# Altium project 数传模块.PrjPCB
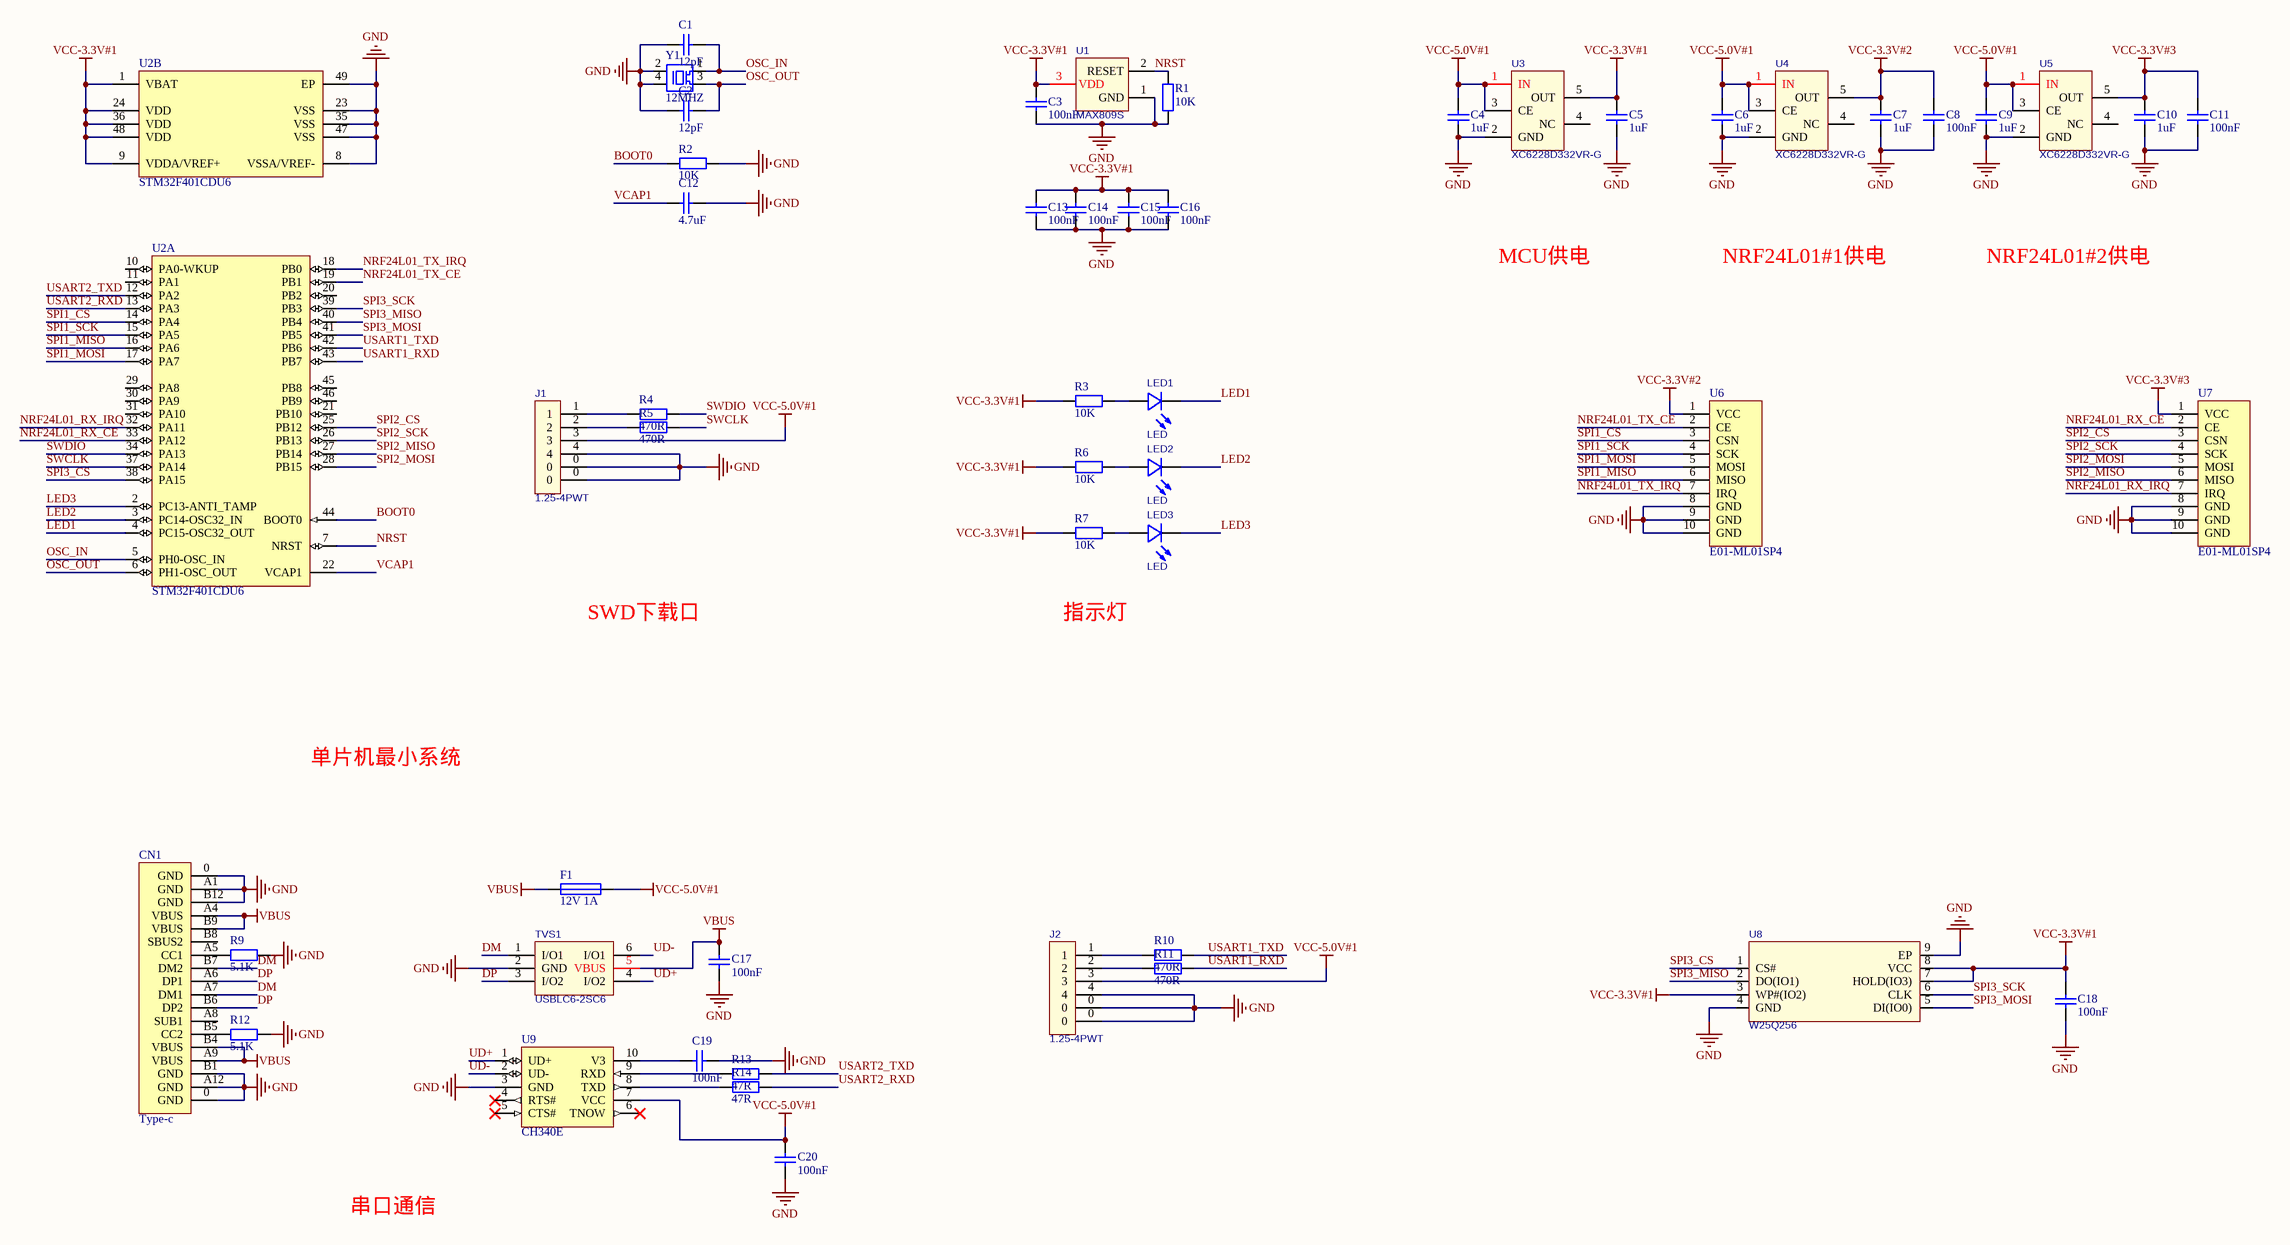
[diagram p0: 数传模块.SchDoc]
1 sheet, 51 parts. Net scope: global (net labels, ports and power ports of the same name join across sheets).
Board file: 数传模块.PcbDoc

## Sheet 数传模块.SchDoc
size A2

### Parts
C1  12pF  [0603-C]
C2  12pF  [0603-C]
C3  100nF  [0603-C]
C4  1uF  [0603-C]
C5  1uF  [0603-C]
C6  1uF  [0603-C]
C7  1uF  [0603-C]
C8  100nF  [0603-C]
C9  1uF  [0603-C]
C10  1uF  [0603-C]
C11  100nF  [0603-C]
C12  4.7uF  [0603-C]
C13  100nF  [0603-C]
C14  100nF  [0603-C]
C15  100nF  [0603-C]
C16  100nF  [0603-C]
C17  100nF  [0603-C]
C18  100nF  [0603-C]
C19  100nF  [0603-C]
C20  100nF  [0603-C]
CN1  Type-c  [Type-c 16pin]
F1  12V 1A  [0805-FUSE]
J1  1.25-4PWT  [H1.25-4P]
J2  1.25-4PWT  [H1.25-4P]
LED1  LED  [LED-0603]
LED2  LED  [LED-0603]
LED3  LED  [LED-0603]
R1  10K  [0603-R]
R2  10K  [0603-R]
R3  10K  [0603-R]
R4  470R  [0603-R]
R5  470R  [0603-R]
R6  10K  [0603-R]
R7  10K  [0603-R]
R9  5.1K  [0603-R]
R10  470R  [0603-R]
R11  470R  [0603-R]
R12  5.1K  [0603-R]
R13  47R  [0603-R]
R14  47R  [0603-R]
TVS1  USBLC6-2SC6  [USBLC6-2]
U1  MAX809S  [MAX809S]
U2  STM32F401CDU6  [STM32F401CDU6]  (parts A,B of 2)
U3  XC6228D332VR-G  [XC6228D332VR-G]
U4  XC6228D332VR-G  [XC6228D332VR-G]
U5  XC6228D332VR-G  [XC6228D332VR-G]
U6  E01-ML01SP4  [PE01-ML01SP4]
U7  E01-ML01SP4  [PE01-ML01SP4]
U8  W25Q256  [W25Q256]
U9  CH340E  [CH340E]
Y1  12MHZ  [3225]

### Nets
GND: C1.1 C2.1 C3.2 C4.1 C5.1 C6.1 C7.1 C8.1 C9.1 C10.1 C11.1 C12.2 C13.1 C14.1 C15.1 C16.1 C17.2 C18.2 C19.2 C20.2 CN1.0(GND) CN1.A1(GND) CN1.A12(GND) CN1.B1(GND) CN1.B12(GND) J1.0 J1.4 J2.0 J2.4 R1.1 R2.2 R9.1 R12.2 TVS1.2(GND) U1.1(GND) U2.8(VSSA/VREF-) U2.23(VSS) U2.35(VSS) U2.47(VSS) U2.49(EP) U3.2(GND) U4.2(GND) U5.2(GND) U6.8(GND) U6.9(GND) U6.10(GND) U7.8(GND) U7.9(GND) U7.10(GND) U8.4(GND) U8.9(EP) U9.3(GND) Y1.2(GND) Y1.4(GND)
VBUS: C17.1 CN1.A4(VBUS) CN1.A9(VBUS) CN1.B4(VBUS) CN1.B9(VBUS) F1.2 TVS1.5(VBUS)
VCC-3.3V#1: C3.1 C5.2 C13.2 C14.2 C15.2 C16.2 C18.1 R3.2 R6.2 R7.2 U1.3(VDD) U2.1(VBAT) U2.9(VDDA/VREF+) U2.24(VDD) U2.36(VDD) U2.48(VDD) U3.5(OUT) U8.3(WP#(IO2)) U8.7(HOLD(IO3)) U8.8(VCC)
VCC-3.3V#2: C7.2 C8.2 U4.5(OUT) U6.1(VCC)
VCC-3.3V#3: C10.2 C11.2 U5.5(OUT) U7.1(VCC)
VCC-5.0V#1: C4.2 C6.2 C9.2 C20.1 F1.1 J1.3 J2.3 U3.1(IN) U3.3(CE) U4.1(IN) U4.3(CE) U5.1(IN) U5.3(CE) U9.7(VCC)
BOOT0: R2.1 U2.44(BOOT0)
DM: CN1.A7(DM1) CN1.B7(DM2) TVS1.1(I/O1)
DP: CN1.A6(DP1) CN1.B6(DP2) TVS1.3(I/O2)
LED1: LED1.1(-) U2.4(PC15-OSC32_OUT)
LED2: LED2.1(-) U2.3(PC14-OSC32_IN)
LED3: LED3.1(-) U2.2(PC13-ANTI_TAMP)
NRF24L01_RX_CE: U2.33(PA12) U7.2(CE)
NRF24L01_RX_IRQ: U2.32(PA11) U7.7(IRQ)
NRF24L01_TX_CE: U2.19(PB1) U6.2(CE)
NRF24L01_TX_IRQ: U2.18(PB0) U6.7(IRQ)
NRST: R1.2 U1.2(RESET) U2.7(NRST)
OSC_IN: C1.2 U2.5(PH0-OSC_IN) Y1.1(XTAL1)
OSC_OUT: C2.2 U2.6(PH1-OSC_OUT) Y1.3(XTAL3)
SPI1_CS: U2.14(PA4) U6.3(CSN)
SPI1_MISO: U2.16(PA6) U6.6(MISO)
SPI1_MOSI: U2.17(PA7) U6.5(MOSI)
SPI1_SCK: U2.15(PA5) U6.4(SCK)
SPI2_CS: U2.25(PB12) U7.3(CSN)
SPI2_MISO: U2.27(PB14) U7.6(MISO)
SPI2_MOSI: U2.28(PB15) U7.5(MOSI)
SPI2_SCK: U2.26(PB13) U7.4(SCK)
SPI3_CS: U2.38(PA15) U8.1(CS#)
SPI3_MISO: U2.40(PB4) U8.2(DO(IO1))
SPI3_MOSI: U2.41(PB5) U8.5(DI(IO0))
SPI3_SCK: U2.39(PB3) U8.6(CLK)
SWCLK: R5.2 U2.37(PA14)
SWDIO: R4.2 U2.34(PA13)
UD+: TVS1.4(I/O2) U9.1(UD+)
UD-: TVS1.6(I/O1) U9.2(UD-)
USART1_RXD: R11.2 U2.43(PB7)
USART1_TXD: R10.2 U2.42(PB6)
USART2_RXD: R14.1 U2.13(PA3)
USART2_TXD: R13.1 U2.12(PA2)
VCAP1: C12.1 U2.22(VCAP1)
NetC19_1: C19.1 U9.10(V3)
NetCN1_A5: CN1.A5(CC1) R9.2
NetCN1_B5: CN1.B5(CC2) R12.1
NetJ1_1: J1.1 R4.1
NetJ1_2: J1.2 R5.1
NetJ2_1: J2.1 R10.1
NetJ2_2: J2.2 R11.1
NetLED1_2: LED1.2(+) R3.1
NetLED2_2: LED2.2(+) R6.1
NetLED3_2: LED3.2(+) R7.1
NetR13_2: R13.2 U9.9(RXD)
NetR14_2: R14.2 U9.8(TXD)

Not connected (* = marked no-connect by the designer): CN1 A8(SUB1) B8(SBUS2); U2 10(PA0-WKUP) 11(PA1) 20(PB2) 21(PB10) 29(PA8) 30(PA9) 31(PA10) 45(PB8) 46(PB9); U3 4(NC); U4 4(NC); U5 4(NC); U9 4(RTS#)* 5(CTS#)* 6(TNOW)*

### Notes on the sheet
- MCU供电
- NRF24L01#1供电
- NRF24L01#2供电
- SWD下载口
- 指示灯
- 单片机最小系统
- 串口通信

### Library data of the parts
C1-C20 = C: 贴片电容; BOM名称: 无极性贴片电容; 联系卖家，免费查找封装: 唯一出售店铺网址https://shop463601444.taobao.com
CN1 = Type-c: U262-161N-4BVC11
F1 = FUSE: 12V,自恢复保险丝
J1 J2 = H1.25-4P: BOM_Manufacturer: FG(富港); Contributor: LCSC; BOM_Supplier: LCSC; BOM_Supplier Part: C2763632; BOM_Manufacturer Part: 1.25-4PWT; JLCPCB Part Class: Extended Part; spicePre: C; spiceSymbolName: 1.25-4PWT
LED1-LED3 = LED: BOM_Manufacturer: Wuxi ARK Tech Elec; BOM_Manufacturer Part: D-G060306G1-KS2; Contributor: LCSC; BOM_Supplier: LCSC; BOM_Supplier Part: C118334; BOM_JLCPCB Part Class: Extended Part; spicePre: L; spiceSymbolName: D-G060306G1-KS2
R1-R7 R9-R14 = R: 贴片电阻; 联系卖家，免费查找封装: 唯一出售店铺网址https://shop463601444.taobao.com; BOM名称: 贴片电阻
TVS1 = USBLC6-2SC6: USBLC6-2SC6_C2687116; BOM_Manufacturer: UMW(友台半导体); Contributor: LCSC; BOM_Supplier: LCSC; BOM_Supplier Part: C2687116; BOM_Manufacturer Part: USBLC6-2SC6; BOM_JLCPCB Part Class: Extended Part; spicePre: D; spiceSymbolName: USBLC6-2SC6_C2687116
U1 = MAX809S: BOM_Manufacturer: Youtai Semiconductor Co., Ltd.; Contributor: LCSC; BOM_Supplier: LCSC; BOM_Supplier Part: C347371; BOM_Manufacturer Part: MAX809S; BOM_JLCPCB Part Class: Extended Part; spicePre: U; spiceSymbolName: MAX809S
U2 = STM32F401CDU6: ARM Cortex-M4 32-bit MCU+FPU, 105 DMIPS, 256 kB Flash, 64 kB Internal RAM, 36 I/Os, 48-pin UFQFPN, -40 to 85 degC, Tray; Manufacturer: STMicroelectronics; PartNumber: STM32F401CCU6; FLASH Size (Prog) (kB): 256; I/Os (High Current): 36; Internal RAM Size (kB): 64; Operating Frequency(F) (Processor speed) (MHz): 84; Supply Voltage(Vcc) max (V): 3.6; Supply Voltage(Vcc) min (V): 1.8; DatasheetVersion: Rev. 1; PackageVersion: Rev. 1, 04/2013; PackageReference: UFQFPN48; PackageDescription: 48-Pin Ultra Thin Fine Pitch Quad Flat No-Lead, 7 x 7 x 0.6 mm Body, 0.5 mm Pitch, Exposed Pad; Supplier 1: Newark; Supplier Part Number 1: 19X6217; Supplier 2: Mouser; Supplier Part Number 2: 511-STM32F401CCU6; Core: ARM Cortex-M4; Packing: Tray; Mounting Technology: Surface Mount; ComponentLink1Description: Manufacturer URL; ComponentLink1URL: http://www.st.com/web/en/home.html; ComponentLink2Description: Datasheet; ComponentLink2URL: http://www.st.com/st-web-ui/static/active/en/resource/technical/document/data_brief/DM00071938.pdf; ComponentLink3Description: Package Specification; ComponentLink3URL: http://www.st.com/st-web-ui/static/active/en/resource/technical/document/data_brief/DM00071938.pdf
U3-U5 = XC6228D332VR-G: 输出类型：固定 输出极性：正 输出通道数：1 最大输入电压：5.5V 输出电压：3.3V 压差：305mV@(300mA) 输出电流：300mA 电源纹波抑制比(PSRR)：80dB@(1kHz) 3.3V固定输出，Iout=300mA，Vin=5.5V(Max); BOM_Manufacturer: TOREX; BOM_Supplier: LCSC; BOM_Manufacturer Part: XC6228D332VR-G; BOM_Supplier Part: C69841; BOM_JLCPCB Part Class: Extended Part; spicePre: U; spiceSymbolName: XC6228D332VR-G
U6 U7 = E01-ML01SP4: 贴片NREF24L01
U8 = W25Q256: BOM_Manufacturer: WINBOND(华邦); BOM_Manufacturer Part: W25Q256JVEIQ; Contributor: LCSC; BOM_Supplier: LCSC; BOM_Supplier Part: C2682312; BOM_JLCPCB Part Class: Extended Part; spicePre: U; spiceSymbolName: W25Q256JVEIQ
U9 = CH340E: USB to TTL Serial / UART
Y1 = Y: 无源晶振